# Altium project half-bridge-smps.PrjPcb
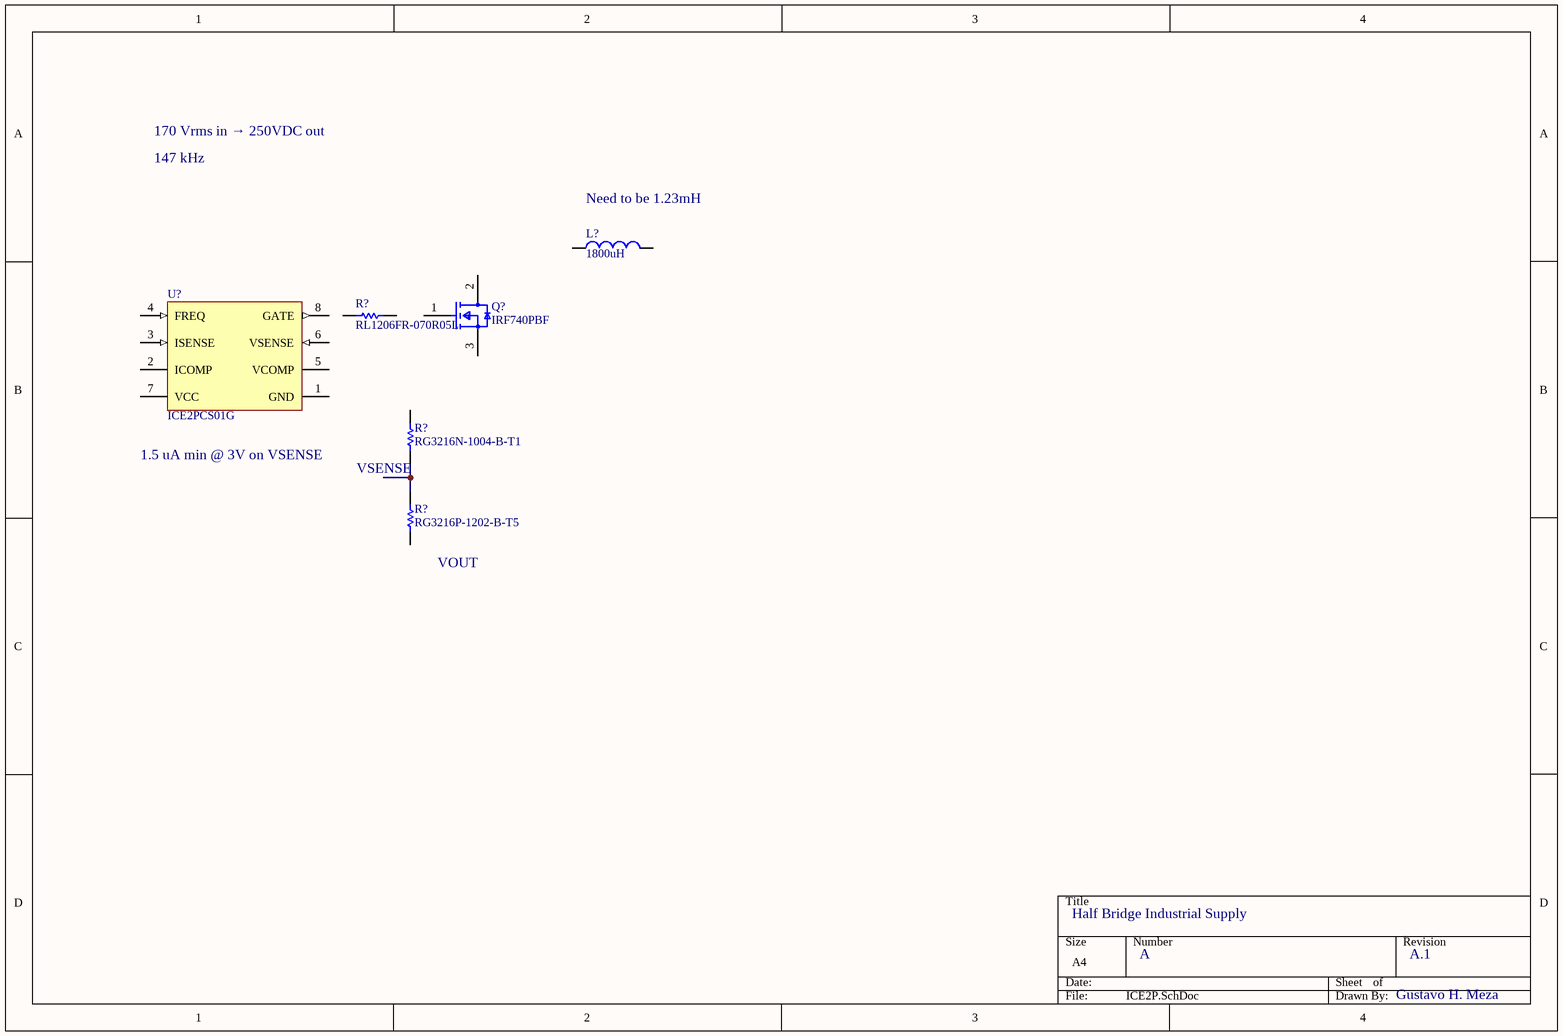
[diagram p0: ICE2P.SchDoc]
1 sheet, 6 parts. Net scope: global (net labels, ports and power ports of the same name join across sheets).

## Sheet ICE2P.SchDoc
size A4; SheetNumber: 2; SheetTotal: 2

### Parts
(Parts that share a designator on the sheet are numbered #1, #2 ... from top to bottom, then left to right.)
L?  value 1800uH  [5723-RC-Footprint-1]  (hidden comment: 5723-RC)
Q?  IRF740PBF  [FP-X15-0364-MFG]
R?#1  RL1206FR-070R05L  [RESC3116X65X40ML10T20]
R?#2  RG3216N-1004-B-T1  [RESC3216X50X50NL20T20]
R?#3  RG3216P-1202-B-T5  [RESC3216X50X50ML20T20]
U?  ICE2PCS01G  [INF-PG-DSO-8-16_N]

### Nets
NetR?#2_1: R?#2.1 R?#3.2

Not connected (* = marked no-connect by the designer): L? 1 2; Q? 1(G) 2(D) 3(S); R?#1 1 2; R?#2 2; R?#3 1; U? 1(GND) 2(ICOMP) 3(ISENSE) 4(FREQ) 5(VCOMP) 6(VSENSE) 7(VCC) 8(GATE)

### Notes on the sheet
- 147 kHz
- 170 Vrms in → 250VDC out
- (near L?) Need to be 1.23mH
- (near U?) 1.5 uA min @ 3V on VSENSE
- (near R?#2) VSENSE
- (near R?#3) VOUT
- Half Bridge Industrial Supply
- A
- A.1
- Gustavo H. Meza

### Library data of the parts
L? = CMP-006-00023-1: General Purpose Inductor, 1800uH, 15%, 1 Element; DC Resistance (DCR): 550mR; Max Current Rating: 2.5A; Inductor Application: HIGH CURRENT INDUCTOR; Min Operating Temperature: -55°C; Pins: 2; RoHS Compliant: Yes; Inductance-Nom (L): 1800uH; Max Operating Temperature: 105°C; Tolerance: 15%; Construction: Shielded
Q? = CMP-02550-000088-1: MOSFET N-CH 400V 10A TO-220AB; Manufacturer: Vishay; Power Dissipation: 125W; Turn On Delay Time: 14ns; Standoff Height: 3.33mm; Max Junction Temp: +150°C; Number Of Channels: 1; Reverse Recovery Charge: 3800nC; Turn Off Delay Time: 50ns; Threshold Vgs Min: 2V; Input Capacitace At Vds: 1400pF @ 25V; Depletion Mode: False; Gate Charge At Vgs: 63nC @ 10V; Rthja Max: 62°C/W; Threshold Vgs Max: 4V; Gate To Source Voltage: 20V; Pulse Drain Current: 40A; Reverse Recovery Time: 370ns; Drain To Source Resistance: 0.55Ω; Temperature Range Low: -55°C; Mouser Description: MOSFET N-Chan 400V 10 Amp; Package: X15-0364; RoHS: TRUE; Manufacturer Part Number: IRF740PBF; Category: Trans; Drain To Source Voltage: 400V; Drain To Source Breakdown Voltage: 400V; Device Class L3: MOSFETs; Lead Free: Yes; Height: 19.89mm; Continuous Drain Current: 10A; Octopart: https://octopart.com/irf740pbf-vishay-46527100; Automotive: No; Max Forward Diode Voltage: 2V; Device Class L1: Discrete Semiconductors; ComponentLink2URL: http://www.vishay.com/docs/91054/91054.pdf; Temperature Range High: +150°C; Device Class L2: Transistors; ComponentLink2Description: Datasheet; Temperature: -55°C to +150°C; Number Of N Channels: 1; Digikey Description: MOSFET N-CH 400V 10A TO-220AB
R?#1 = CMP-2003-04046-1: Manufacturer: Yageo; Part Number: RL1206FR-070R05L
R?#2 = CMP-2003-02632-1: Manufacturer: Susumu; Part Number: RG3216N-1004-B-T1
R?#3 = CMP-2003-02655-1: Manufacturer: Susumu; Part Number: RG3216P-1202-B-T5
U? = CMP-1105-00012-1: Standalone Power Factor Correction (PFC) Controller in Continuous Conduction Mode (CCM), 11 to 26 V, -1.5 A / 2 A Iq, -40 to 125 degC, PG-DSO-8-16, Reel, Green; Manufacturer: Infineon; Output: MOSFET Gate Driver; IQ (max): -1.5Â A / 2 A; Green: TRUE; VCC (max): 26Â V; Group: DSO-8; ICC (max): 20Â mA; Iq (typ): 300Â uA; VCC (min): 11Â V; Frequency ( f ) Range: 50kHz - 250kHz; PackageDescription: 8-Pin Plastic (Green) Dual Small Outline Package, 4.9 x 3.9 mm Body, 1.27 mm Pitch; Mounting Technology: Surface Mount; PackageReference: PG-DSO-8-16; PackageVersion: Mar-07; ComponentLink3Description: Package Specification; ComponentLink3URL: http://www.infineon.com/dgdl/TLE7259-2GE_DS_rev12.pdf?folderId=db3a3043163797a6011666d32a0c0de1&fileId=db3a3043163797a6011666d4dbb80de2&location=en.Products.Automotive_ICs.Automotive_Transceivers.LIN_Transceivers.DATASHEET.TLE7259-2GE_DS_rev12.pdf; Halogen-free: TRUE; ComponentLink1URL: http://www.infineon.com/; ComponentLink1Description: Manufacturer URL; PartNumber: ICE2PCS01G; ComponentLink2URL: http://www.infineon.com/dgdl/ProductDatasheetICE2PCS01_v2_3+Mar+2010.pdf?folderId=db3a304412b407950112b4182a3d24f8&fileId=db3a304412b407950112b427caa43ccf; ComponentLink2Description: Datasheet; DatasheetVersion: Rev. 2.3